# Altium schematic sheet Busmaster.SchDoc: Top Level
size A3; CompanyName: NOT USED; SheetNumber: 0; SheetTotal: 0; PageSetup: Record=PageOptions|CenterHorizontal=True|CenterVertical=True|PrintScale=1.00|XCorrection=1.00|YCorrection=1.00|PrintKind=0|BorderSize=5000000|LeftOffset=0|BottomOffset=0|Orientation=2|PaperLength=1000|PaperWidth=1000|Scale=100|PaperSource=7|PrintQuality=-4|MediaType=1|DitherType=10|PaperKind=A3|PrintScaleMode=0
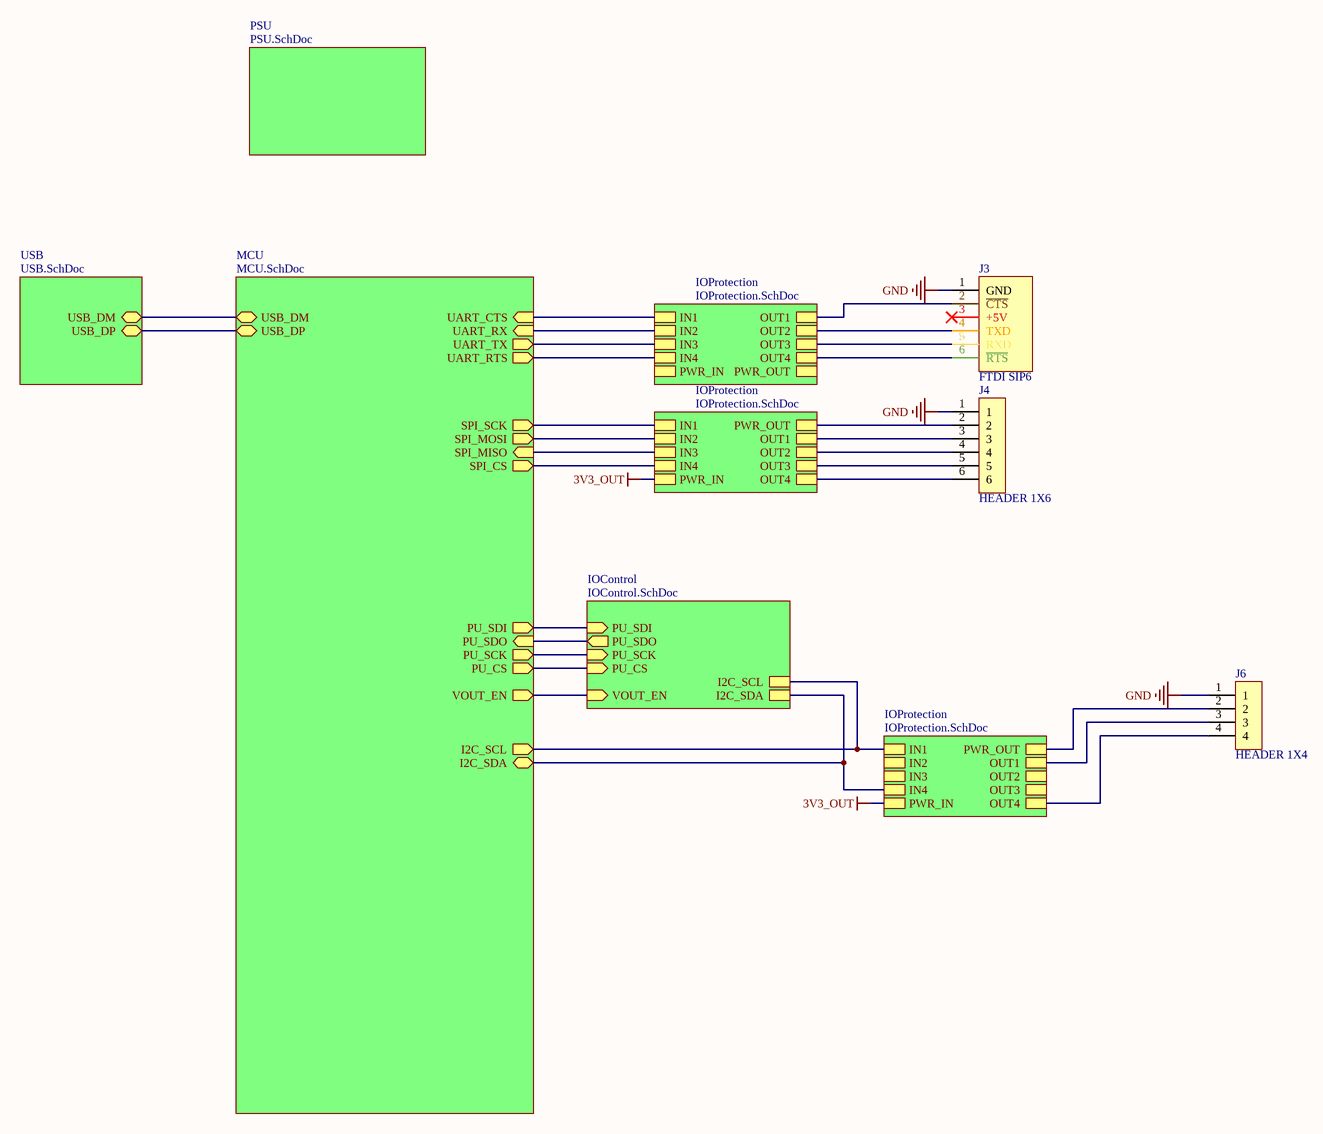
[diagram p0: Busmaster.SchDoc]

## Parts
J3  FTDI SIP6  [HIROSE_A2-6PA-2.54DSA]
J4  HEADER 1X6  [HIROSE_A2-6PA-2.54DSA]
J6  HEADER 1X4  [HIROSE_A2-4PA-2.54DSA]

## Sub-sheets
IOControl = IOControl.SchDoc: VOUT_EN (in), I2C_SCL, I2C_SDA, PU_SDI (in), PU_SDO (out), PU_CS (in), PU_SCK (in)
IOProtection = IOProtection.SchDoc: IN2, OUT4, IN1, OUT1, IN3, IN4, OUT2, OUT3, PWR_IN, PWR_OUT
IOProtection = IOProtection.SchDoc: IN2, OUT4, IN1, OUT1, IN3, IN4, OUT2, OUT3, PWR_IN, PWR_OUT
IOProtection = IOProtection.SchDoc: IN2, OUT4, IN1, OUT1, IN3, IN4, OUT2, OUT3, PWR_OUT, PWR_IN
MCU = MCU.SchDoc: USB_DM (bidir), UART_CTS (in), SPI_CS (out), USB_DP (bidir), I2C_SCL (out), I2C_SDA (bidir), UART_RX (in), SPI_MOSI (out), UART_RTS (out), SPI_MISO (in), UART_TX (out), SPI_SCK (out), VOUT_EN (out), PU_SDI (out), PU_SDO (in), PU_SCK (out), PU_CS (out)
PSU = PSU.SchDoc: no entries
USB = USB.SchDoc: USB_DM (bidir), USB_DP (bidir)

## Nets
3V3_OUT: sheet IOProtection/PWR_IN, sheet IOProtection/PWR_IN
GND: J3.1(GND) J4.1 J6.1
NetJ3_2: J3.2(~{CTS}) ; sheet IOProtection/OUT1
NetJ3_4: J3.4(TXD) ; sheet IOProtection/OUT2
NetJ3_5: J3.5(RXD) ; sheet IOProtection/OUT3
NetJ3_6: J3.6(~{RTS}) ; sheet IOProtection/OUT4
NetJ4_2: J4.2 ; sheet IOProtection/PWR_OUT
NetJ4_3: J4.3 ; sheet IOProtection/OUT1
NetJ4_4: J4.4 ; sheet IOProtection/OUT2
NetJ4_5: J4.5 ; sheet IOProtection/OUT3
NetJ4_6: J4.6 ; sheet IOProtection/OUT4
NetJ6_2: J6.2 ; sheet IOProtection/PWR_OUT
NetJ6_3: J6.3 ; sheet IOProtection/OUT1
NetJ6_4: J6.4 ; sheet IOProtection/OUT4
(unnamed): sheet MCU/USB_DM, sheet USB/USB_DM
(unnamed): sheet MCU/UART_CTS, sheet IOProtection/IN1
(unnamed): sheet MCU/SPI_CS, sheet IOProtection/IN4
(unnamed): sheet MCU/USB_DP, sheet USB/USB_DP
(unnamed): sheet MCU/I2C_SCL, sheet IOProtection/IN1, sheet IOControl/I2C_SCL
(unnamed): sheet MCU/I2C_SDA, sheet IOProtection/IN4, sheet IOControl/I2C_SDA
(unnamed): sheet MCU/UART_RX, sheet IOProtection/IN2
(unnamed): sheet MCU/SPI_MOSI, sheet IOProtection/IN2
(unnamed): sheet MCU/UART_RTS, sheet IOProtection/IN4
(unnamed): sheet MCU/SPI_MISO, sheet IOProtection/IN3
(unnamed): sheet MCU/UART_TX, sheet IOProtection/IN3
(unnamed): sheet MCU/SPI_SCK, sheet IOProtection/IN1
(unnamed): sheet MCU/VOUT_EN, sheet IOControl/VOUT_EN
(unnamed): sheet MCU/PU_SDI, sheet IOControl/PU_SDI
(unnamed): sheet MCU/PU_SDO, sheet IOControl/PU_SDO
(unnamed): sheet MCU/PU_SCK, sheet IOControl/PU_SCK
(unnamed): sheet MCU/PU_CS, sheet IOControl/PU_CS

Not connected (* = marked no-connect by the designer): J3 3(+5V)*

## Notes on the sheet
- Project
- Size:
- Date:
- A3
- Revision:
- Sheet
- of
- Lambo
- File:

## Library data of the parts
J3 = CON-10749-A: FTDI Serial Header; Manufacturer: Hirose Electric Co Ltd; Manufacturer Part Number: A2-6PA-2.54DSA(71); Contacts: 6; Pitch: 2.54mm; Rows: 1; Display_Name: FTDI SIP6; Type: Header; BWA PN: CON-10749-A; Schematic Symbol: FTDI_TTL_232R; Supplier 1: Digi-Key; Supplier Part Number 1: H123043-ND
J4 = CON-10040-A: CONN 6-pin 2.54mm pitch TH single row; Manufacturer: Hirose; Manufacturer Part Number: A2-6PA-2.54DSA; Contacts: 6; Rows: 1; Display_Name: HEADER 1X6; Pitch: 2.54mm; Type: HEADER; BWA PN: CON-10040-A; Schematic Symbol: HIROSE_A2-6PA-2.54DSA
J6 = CON-10039-A: CONN 4-pin 2.54mm pitch TH single row; Manufacturer: Hirose; Manufacturer Part Number: A2-4PA-2.54DSA; Contacts: 4; Rows: 1; Display_Name: HEADER 1X4; Pitch: 2.54mm; BWA PN: CON-10039-A; Schematic Symbol: HIROSE_A2-4PA-2.54DSA